# EAGLE design Esquema (EAGLE 9.6.2)
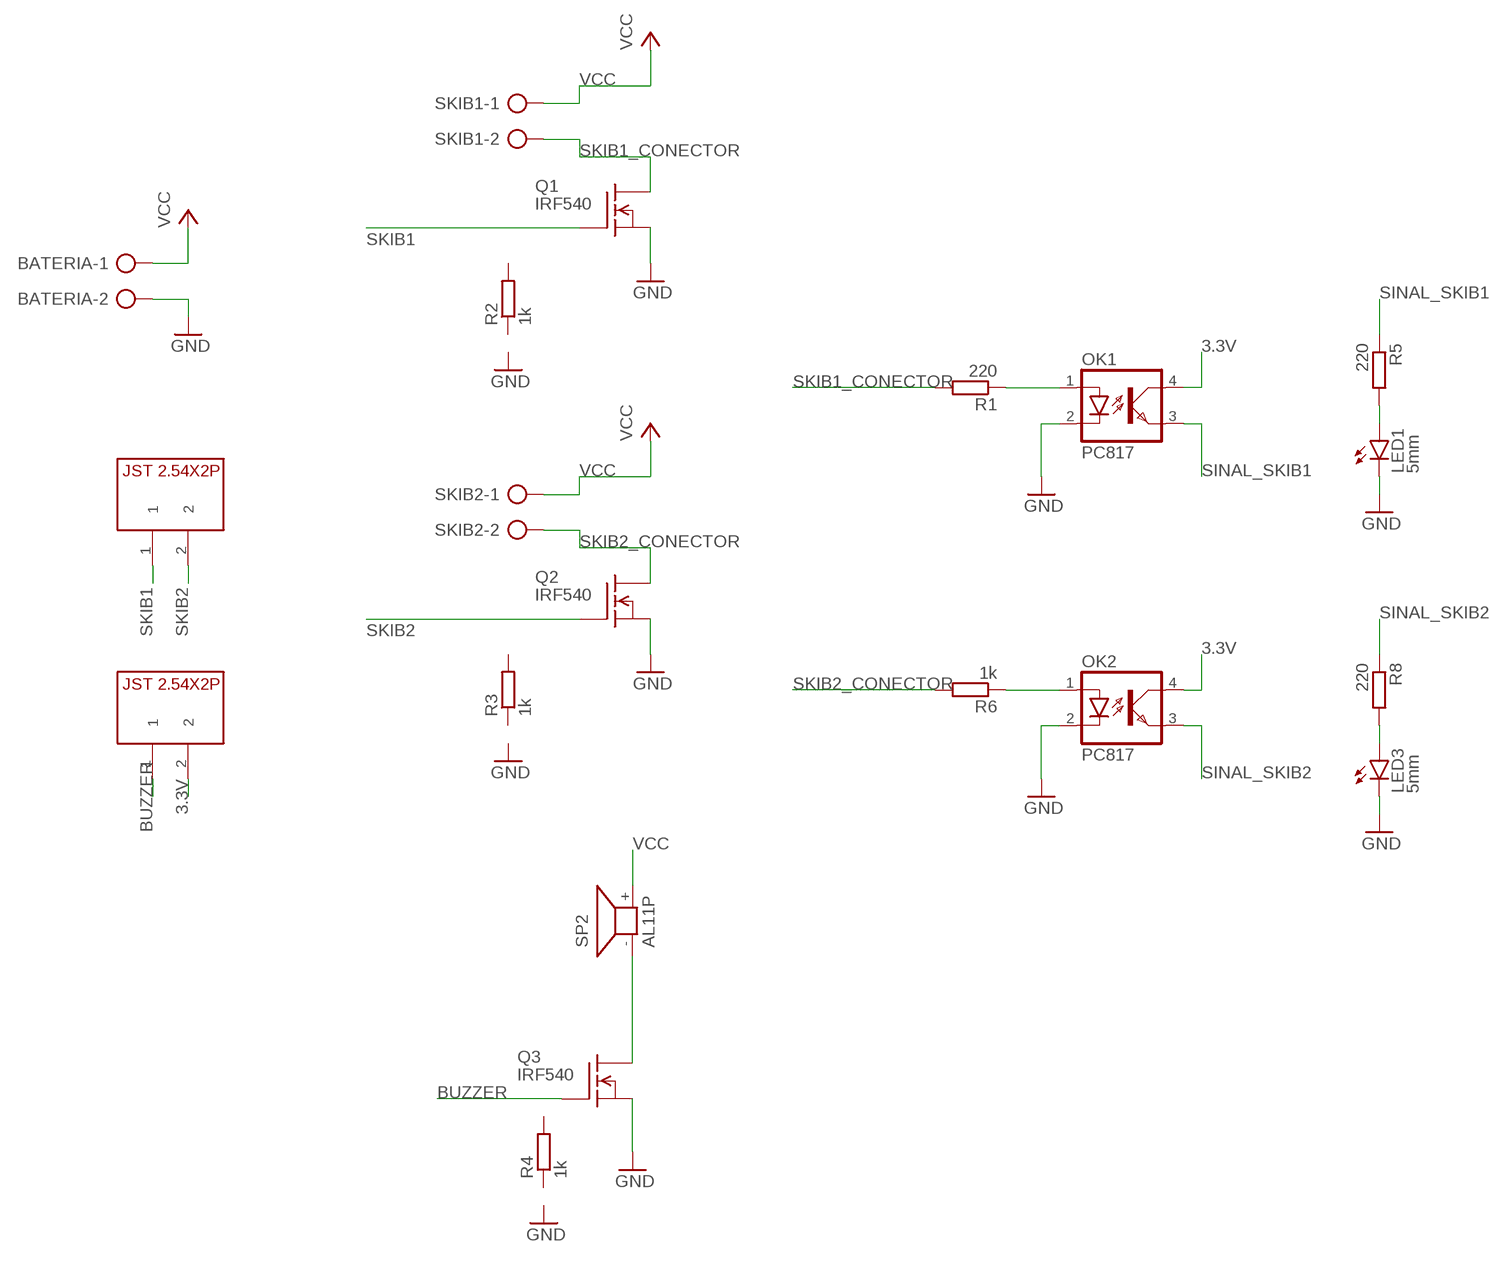
[diagram p0: schematic, sheet 1]

## Parts
BATERIA  AK500/2-H  [AK500/2-H]
LED1  5mm  LED5MM  [LED5MM]
LED3  5mm  LED5MM  [LED5MM]
OK1  PC817  [DIL04]
OK2  PC817  [DIL04]
Q1  IRF540  [TO220]
Q2  IRF540  [TO220]
Q3  IRF540  [TO220]
R1  220  R-EU_0207/10  [0207/10]
R2  1k  R-EU_0207/10  [0207/10]
R3  1k  R-EU_0207/10  [0207/10]
R4  1k  R-EU_0207/10  [0207/10]
R5  220  R-EU_0207/10  [0207/10]
R6  1k  R-EU_0207/10  [0207/10]
R8  220  R-EU_0207/10  [0207/10]
SKIB1  AK500/2-H  [AK500/2-H]
SKIB2  AK500/2-H  [AK500/2-H]
SP2  AL11P  [AL11P]
U$1  JST2.54X2P  [JST2.54X2P_FOOTPRINT]
U$2  JST2.54X2P  [JST2.54X2P_FOOTPRINT]

## Nets
3.3V: OK1.4(COL) OK2.4(COL) U$1.2
BUZZER: Q3.1(G) U$1.1
GND: BATERIA.2 LED1.K(C) LED3.K(C) OK1.2(C) OK2.2(C) Q1.3(S) Q2.3(S) Q3.3(S)
N$2: Q3.2(D) SP2.-
N$3: LED3.A R8.2
N$4: OK1.1(A) R1.1
N$5: OK2.1(A) R6.1
N$6: LED1.A R5.2
SINAL_SKIB1: OK1.3(EMIT) R5.1
SINAL_SKIB2: OK2.3(EMIT) R8.1
SKIB1: Q1.1(G) U$2.1
SKIB1_CONECTOR: Q1.2(D) R1.2 SKIB1.2
SKIB2: Q2.1(G) U$2.2
SKIB2_CONECTOR: Q2.2(D) R6.2 SKIB2.2
VCC: BATERIA.1 SKIB1.1 SKIB2.1 SP2.+
Unconnected: R2.1 R2.2 R3.1 R3.2 R4.1 R4.2

## Library data of the parts
BATERIA SKIB1 SKIB2 = con-ptr500:AK500/2-H: CONNECTOR Aug. 2004 / PTR Meßtechnik: Die Bezeichnung der Serie AK505 wurde geändert. Es handelt sich hierbei um AK500 in horizontaler Ausführung.; OC_FARNELL: unknown; OC_NEWARK: unknown
LED1 LED3 = led:LED: LED OSRAM: - CHIPLED LG R971, LG N971, LY N971, LG Q971, LY Q971, LO R971, LY R971 LH N974, LH R974 LS Q976, LO Q976, LY Q976 LO Q996 - Hyper CHIPLED LW Q18S LB Q993, LB Q99A, LB R99A - SideLED LS A670, LO A670, LY A670, LG A670, LP A670 LB A673, LV A673, LT A673, LW A673 LH A674 LY A675 LS A676, LA A676, LO A676, LY A676, LW A676 LS A679, LY A679, LG A679 - Hyper Micro SIDELED® LS Y876, LA Y876, LO Y876, LY Y876 LT Y87S - SmartLED LW L88C, LW L88S LB L89C, LB L89S, LG L890 LS L89K, LO L89K, LY L89K LS L896, LA L896, LO L896, LY L896 - TOPLED LS T670, LO T670, LY T670, LG T670, LP T670 LSG T670, LSP T670, LSY T670, LOP T670, LYG T670 LG T671, LOG T671, LSG T671 LB T673, LV T673, LT T673, LW T673 LH T674 LS T676, LA T676, LO T676, LY T676, LB T676, LH T676, LSB T676, LW T676 LB T67C, LV T67C, LT T67C, LS T67K, LO T67K, LY T67K, LW E67C LS E67B, LA E67B, LO E67B, LY E67B, LB E67C, LV E67C, LT E67C LW T67C LS T679, LY T679, LG T679 LS T770, LO T770, LY T770, LG T770, LP T770 LB T773, LV T773, LT T773, LW T773 LH T774 LS E675, LA E675, LY E675, LS T675 LS T776, LA T776, LO T776, LY T776, LB T776 LHGB T686 LT T68C, LB T68C - Hyper Mini TOPLED® LB M676 - Mini TOPLED Santana® LG M470 LS M47K, LO M47K, LY M47K Source: http://www.osram.convergy.de LUXEON: - LUMILED® LXK2-PW12-R00, LXK2-PW12-S00, LXK2-PW14-U00, LXK2-PW14-V00 LXK2-PM12-R00, LXK2-PM12-S00, LXK2-PM14-U00 LXK2-PE12-Q00, LXK2-PE12-R00, LXK2-PE12-S00, LXK2-PE14-T00, LXK2-PE14-U00 LXK2-PB12-K00, LXK2-PB12-L00, LXK2-PB12-M00, LXK2-PB14-N00, LXK2-PB14-P00, LXK2-PB14-Q00 LXK2-PR12-L00, LXK2-PR12-M00, LXK2-PR14-Q00, LXK2-PR14-R00 LXK2-PD12-Q00, LXK2-PD12-R00, LXK2-PD12-S00 LXK2-PH12-R00, LXK2-PH12-S00 LXK2-PL12-P00, LXK2-PL12-Q00, LXK2-PL12-R00 Source: www.luxeon.com KINGBRIGHT: KA-3528ASYC Source: www.kingbright.com
OK1 OK2 = optocoupler:PC817: SHARP OPTO COUPLER; MPN: PC817X4J000F; OC_FARNELL: 9707727; OC_NEWARK: 97K7059
Q1-Q3 = transistor-fet:IRF540: N-Channel Enhancement MOSFET (HEXFET); 100V; 28A; 0,077Ohm
R1-R6 R8 = rcl:R-EU_: RESISTOR, European symbol; SPICEPREFIX: R
SP2 = buzzer:AL11P: SPEAKER Source: Buerklin; OC_FARNELL: unknown; OC_NEWARK: unknown
U$1 U$2 = CRD:JST2.54X2P: Conector JST 2 pinos (2.54mm de distância entre pinos)

## Board
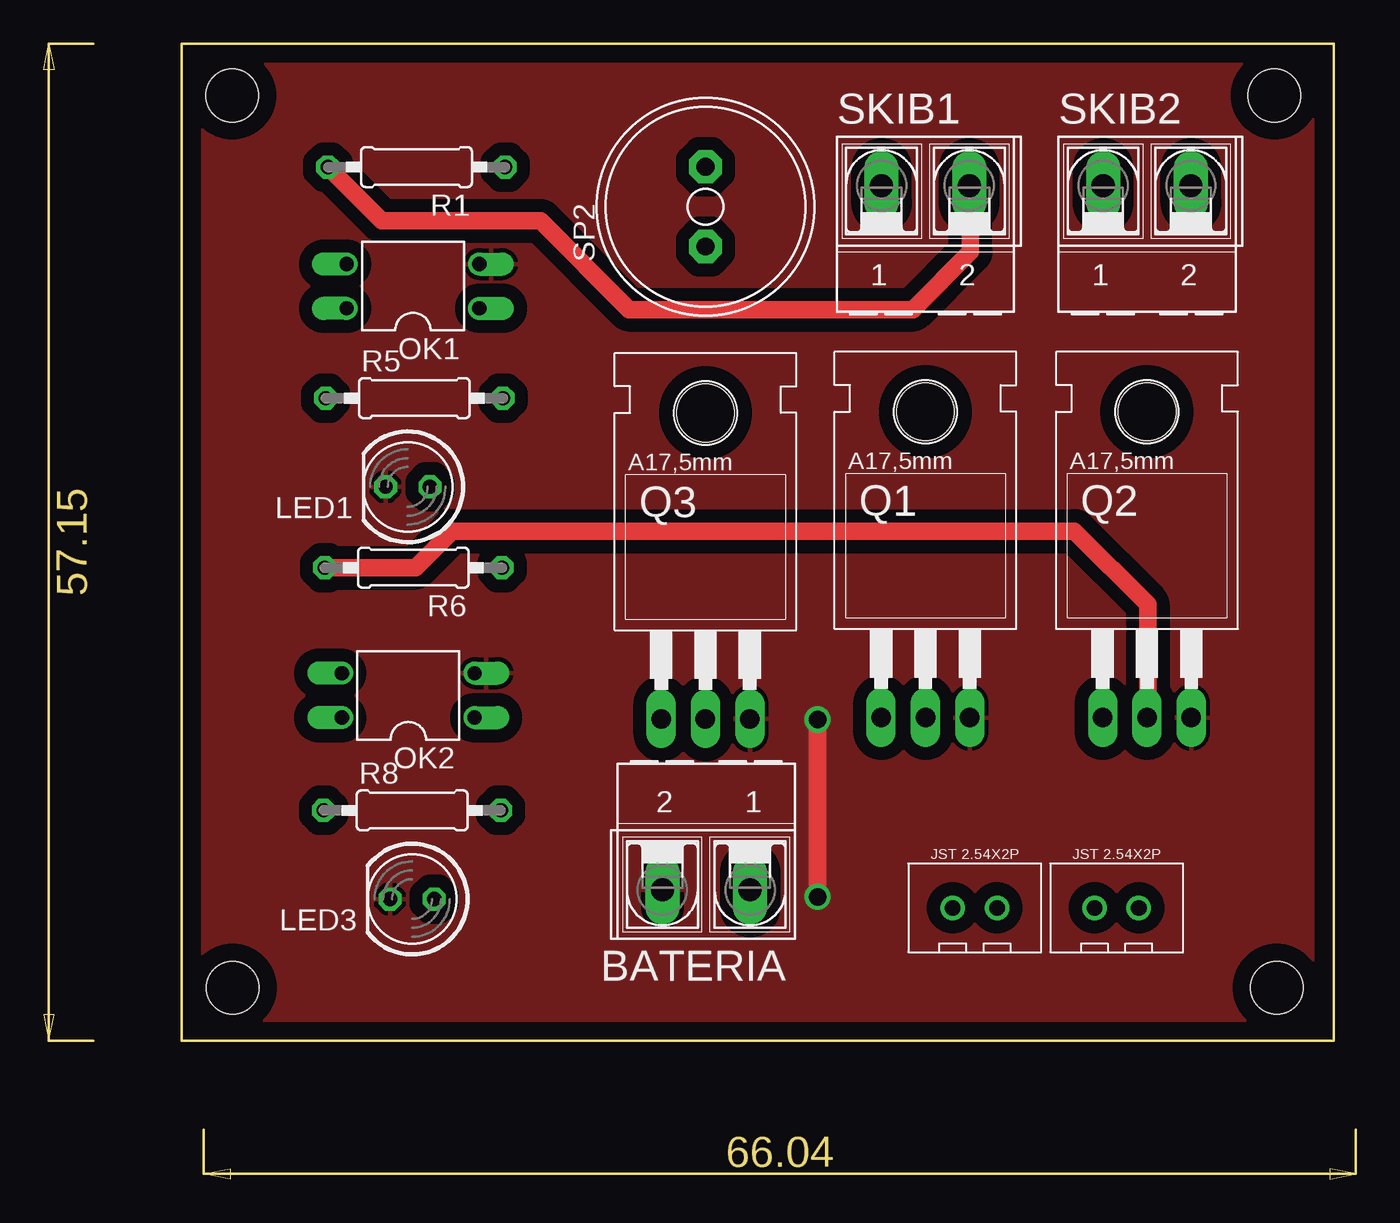
[diagram p1: board, top side]
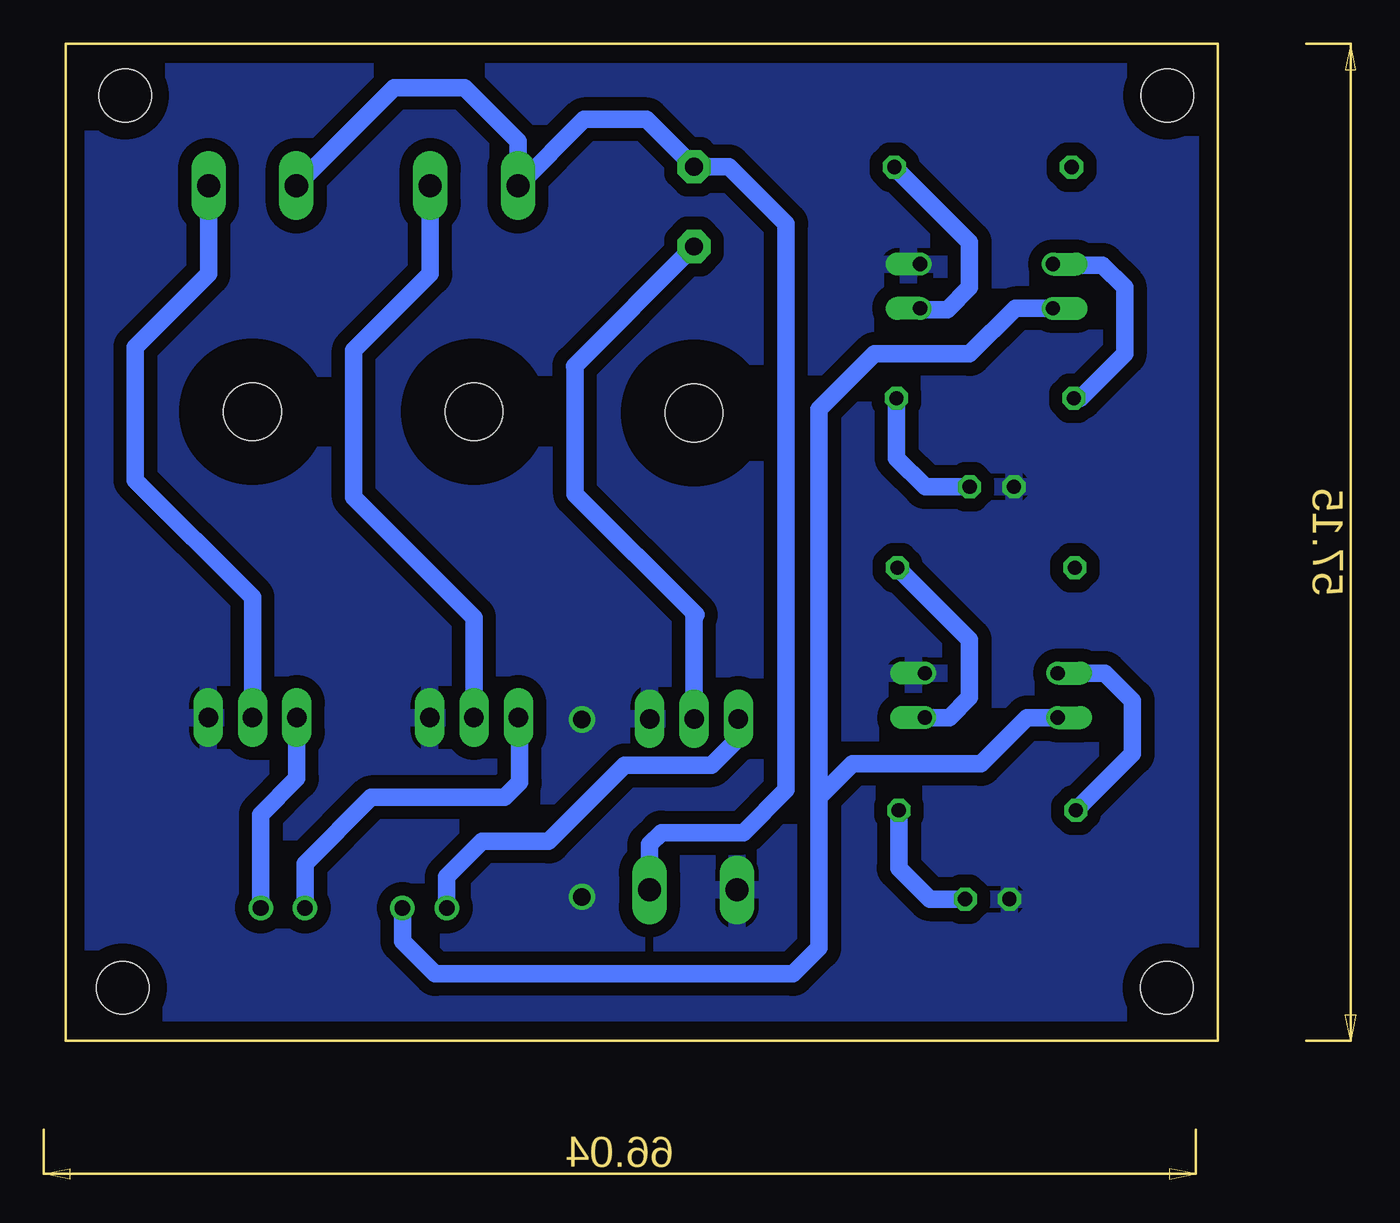
[diagram p2: board, bottom side, seen from below]

Size 66.04 x 57.15 mm. Coordinates in mm from the lower left corner, seen from the top.
Outline: 0,57.15 0,0 66.04,0 66.04,57.15 0,57.15
Copper layers (1*16): Top 0.035mm / dielectric 1.5mm / Bottom 0.035mm
Design rules "default *": minimum track width 1mm, minimum drill 0.35mm, track to track 30mil, track to pad 0.5mm, pad to pad 6mil, via to via 6mil, smd to smd 6mil, copper to edge 40mil, drill to drill 6mil, minimum pad ring 10mil, minimum via ring 8mil, stop-mask expansion 4mil, vias tented up to drill 0mil, thermal gap 10mil
Holes 3 mm at 2.89,54.17 62.64,54.17 2.92,3.05 62.77,3.05

### Footprints (pad centres in the part's own frame; a part is rotated, then mirrored left to right if it is on the bottom)
AK500/2-H = drill 1.321 long: 1 -2.515,0; 2 2.515,0
LED5MM = drill 0.813 octagon: A -1.27,0; K 1.27,0
DIL04 = drill 0.813 offset: 1 -1.27,-3.81; 2 1.27,-3.81; 3 1.27,3.81; 4 -1.27,3.81
TO220 = drill 1.118 long: 1 -2.54,-6.35; 2 0,-6.35; 3 2.54,-6.35 | hole 3.302: 0,11.176
0207/10 = drill 0.813 octagon: 1 -5.08,0; 2 5.08,0
AL11P = drill 1.016 pad 1.905 octagon: + 2.286,0; - -2.286,0
JST2.54X2P_FOOTPRINT = drill 0.9: 1 -1.27,0; 2 1.27,0

### Placement (x,y rotation side)
BATERIA  30.06,8.65 180 top
LED1  12.95,31.75 180 top
LED3  13.21,8.13 180 top
OK1  13.25,43.25 90 top
OK2  12.98,19.8 90 top
Q1  42.63,24.88 0 top
Q2  55.33,24.88 0 top
Q3  30.02,24.81 0 top
R1  13.46,50.08 180 top
R2  77.37,10.49 0 top  (outside the outline)
R3  77.37,5.89 0 top  (outside the outline)
R4  77.37,1.29 0 top  (outside the outline)
R5  13.34,36.83 0 top
R6  13.28,27.12 180 top
R8  13.21,13.21 0 top
SKIB1  42.63,49.01 0 top
SKIB2  55.33,49.01 0 top
SP2  30.02,47.81 90 top
U$1  45.47,7.62 0 top
U$2  53.59,7.62 0 top

### Tracks (layer width: path | path; a pad name or v marks a point on that pad's centre or on a via)
3.3V
  Bottom 1: 22.86,13.97 22.86,36.18 19.67,39.37 14.22,39.37 11.61,41.98 OK1.4 | 22.86,13.97 22.86,5.33 24.36,3.83 44.86,3.83 46.74,5.71 U$1.2 | OK2.4 10.93,18.53 13.59,15.88 20.95,15.88 22.86,13.97
BUZZER
  Bottom 1: Q3.1 27.48,17.35 29.02,15.81 29.24,15.81 29.26,15.78 34,15.78 38.35,11.43 42.16,11.43 44.2,9.4 U$1.1
GND  (via drill 1)
  Top 1: v36.45,18.41 v36.45,8.26
  pour Bottom: 65.02,56.43 65.02,0.54 0.59,0.54 0.59,56.43
  pour Top: 0,57.15 0,0 66.04,0 66.04,57.15
N$2
  Bottom 1: SP2.- 36.89,38.66 36.83,38.61 36.83,31.32 29.92,24.41 30.02,24.31 Q3.2
N$3
  Bottom 1: R8.2 18.29,9.91 16.51,8.13 LED3.A
N$4
  Bottom 1: R1.1 14.22,45.76 14.22,43.18 15.49,41.91 16.99,41.91 OK1.1
N$5
  Bottom 1: R6.1 14.22,22.98 14.22,19.68 15.38,18.53 OK2.1
N$6
  Bottom 1: R5.2 18.41,33.4 16.76,31.75 LED1.A
SINAL_SKIB1
  Bottom 1: OK1.3 9.37,44.45 6.6,44.45 5.33,43.18 5.33,39.37 7.87,36.83 R5.1
SINAL_SKIB2
  Bottom 1: OK2.3 6.49,21.07 6.48,21.08 4.89,19.49 4.89,16.45 R8.1
SKIB1
  Bottom 1: Q1.1 40.02,18.46 40.02,14.81 40.88,13.96 48.53,13.96 52.32,10.16 U$2.1
SKIB1_CONECTOR
  Top 1: R1.2 11.46,46.99 20.57,46.99 25.65,41.91 41.91,41.91 45.21,45.21 45.21,48.95 SKIB1.2
  Bottom 1: Q1.2 42.63,24.26 49.53,31.16 49.53,39.57 45.15,43.95 SKIB1.2
SKIB2
  Bottom 1: Q2.1 52.79,15.04 54.86,12.97 U$2.2
SKIB2_CONECTOR
  Top 1: R6.2 13.4,27.12 15.49,29.21 51.18,29.21 55.37,25.02 55.37,18.57 Q2.2
  Bottom 1: Q2.2 55.33,25.42 62.05,32.13 62.05,39.76 57.85,43.95 SKIB2.2
VCC
  Bottom 1: BATERIA.1 32.58,11.26 31.89,11.94 27.19,11.94 24.75,14.38 24.75,46.82 28.02,50.1 SP2.+ 32.74,52.81 36.32,52.81 SKIB1.1 40.12,51.55 43.18,54.61 47.22,54.61 SKIB2.1